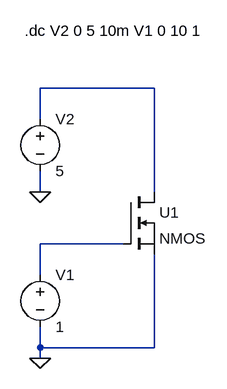
[diagram p0: schematic BS170_test.asc]
BS170_test.asc, the LTspice schematic file:
Version 4
SHEET 1 1204 680
WIRE 320 -32 144 -32
WIRE 144 16 144 -32
WIRE 144 128 144 96
WIRE 320 128 320 -32
WIRE 272 208 144 208
WIRE 144 256 144 208
WIRE 144 368 144 336
WIRE 320 368 320 224
WIRE 320 368 144 368
WIRE 144 384 144 368
FLAG 144 384 0
FLAG 144 128 0
SYMBOL voltage 144 240 R0
SYMATTR InstName V1
SYMATTR Value 1
SYMBOL voltage 144 0 R0
SYMATTR InstName V2
SYMATTR Value 5
SYMBOL addon\\Transistors\\NMOS 272 128 R0
SYMATTR InstName U1
TEXT 120 -120 Left 2 !.dc V2 0 5 10m V1 0 10 1

The netlist it stands for:
* BS170_test.asc
V1 N002 0 1
V2 N001 0 5
M§U1 N001 N002 0 0 NMOS
.model NMOS NMOS
.model PMOS PMOS
.lib standard.mos
.dc V2 0 5 10m V1 0 10 1
.backanno
.end